# Altium project SCB.PrjPCB (part 2 of 2)

## Sheet FPGA_Configuration.SchDoc: FPGA_Configuration
size A3; Date: 18/06/2014; DrawnBy: J. Gabriel R.E.; Organization: Seven Solutions S.L.; Address1: C/Baza, Parcela 19, Nave 3; Address2: Polнgono Ind. Juncaril; Address3: 18210-Peligros-Granada; Address4: Spain; Revision: 3.4; SheetNumber: 8; SheetTotal: 23; WebAddress: www.sevensols.com; Project: White Rabbit; ProjectName: Project Name
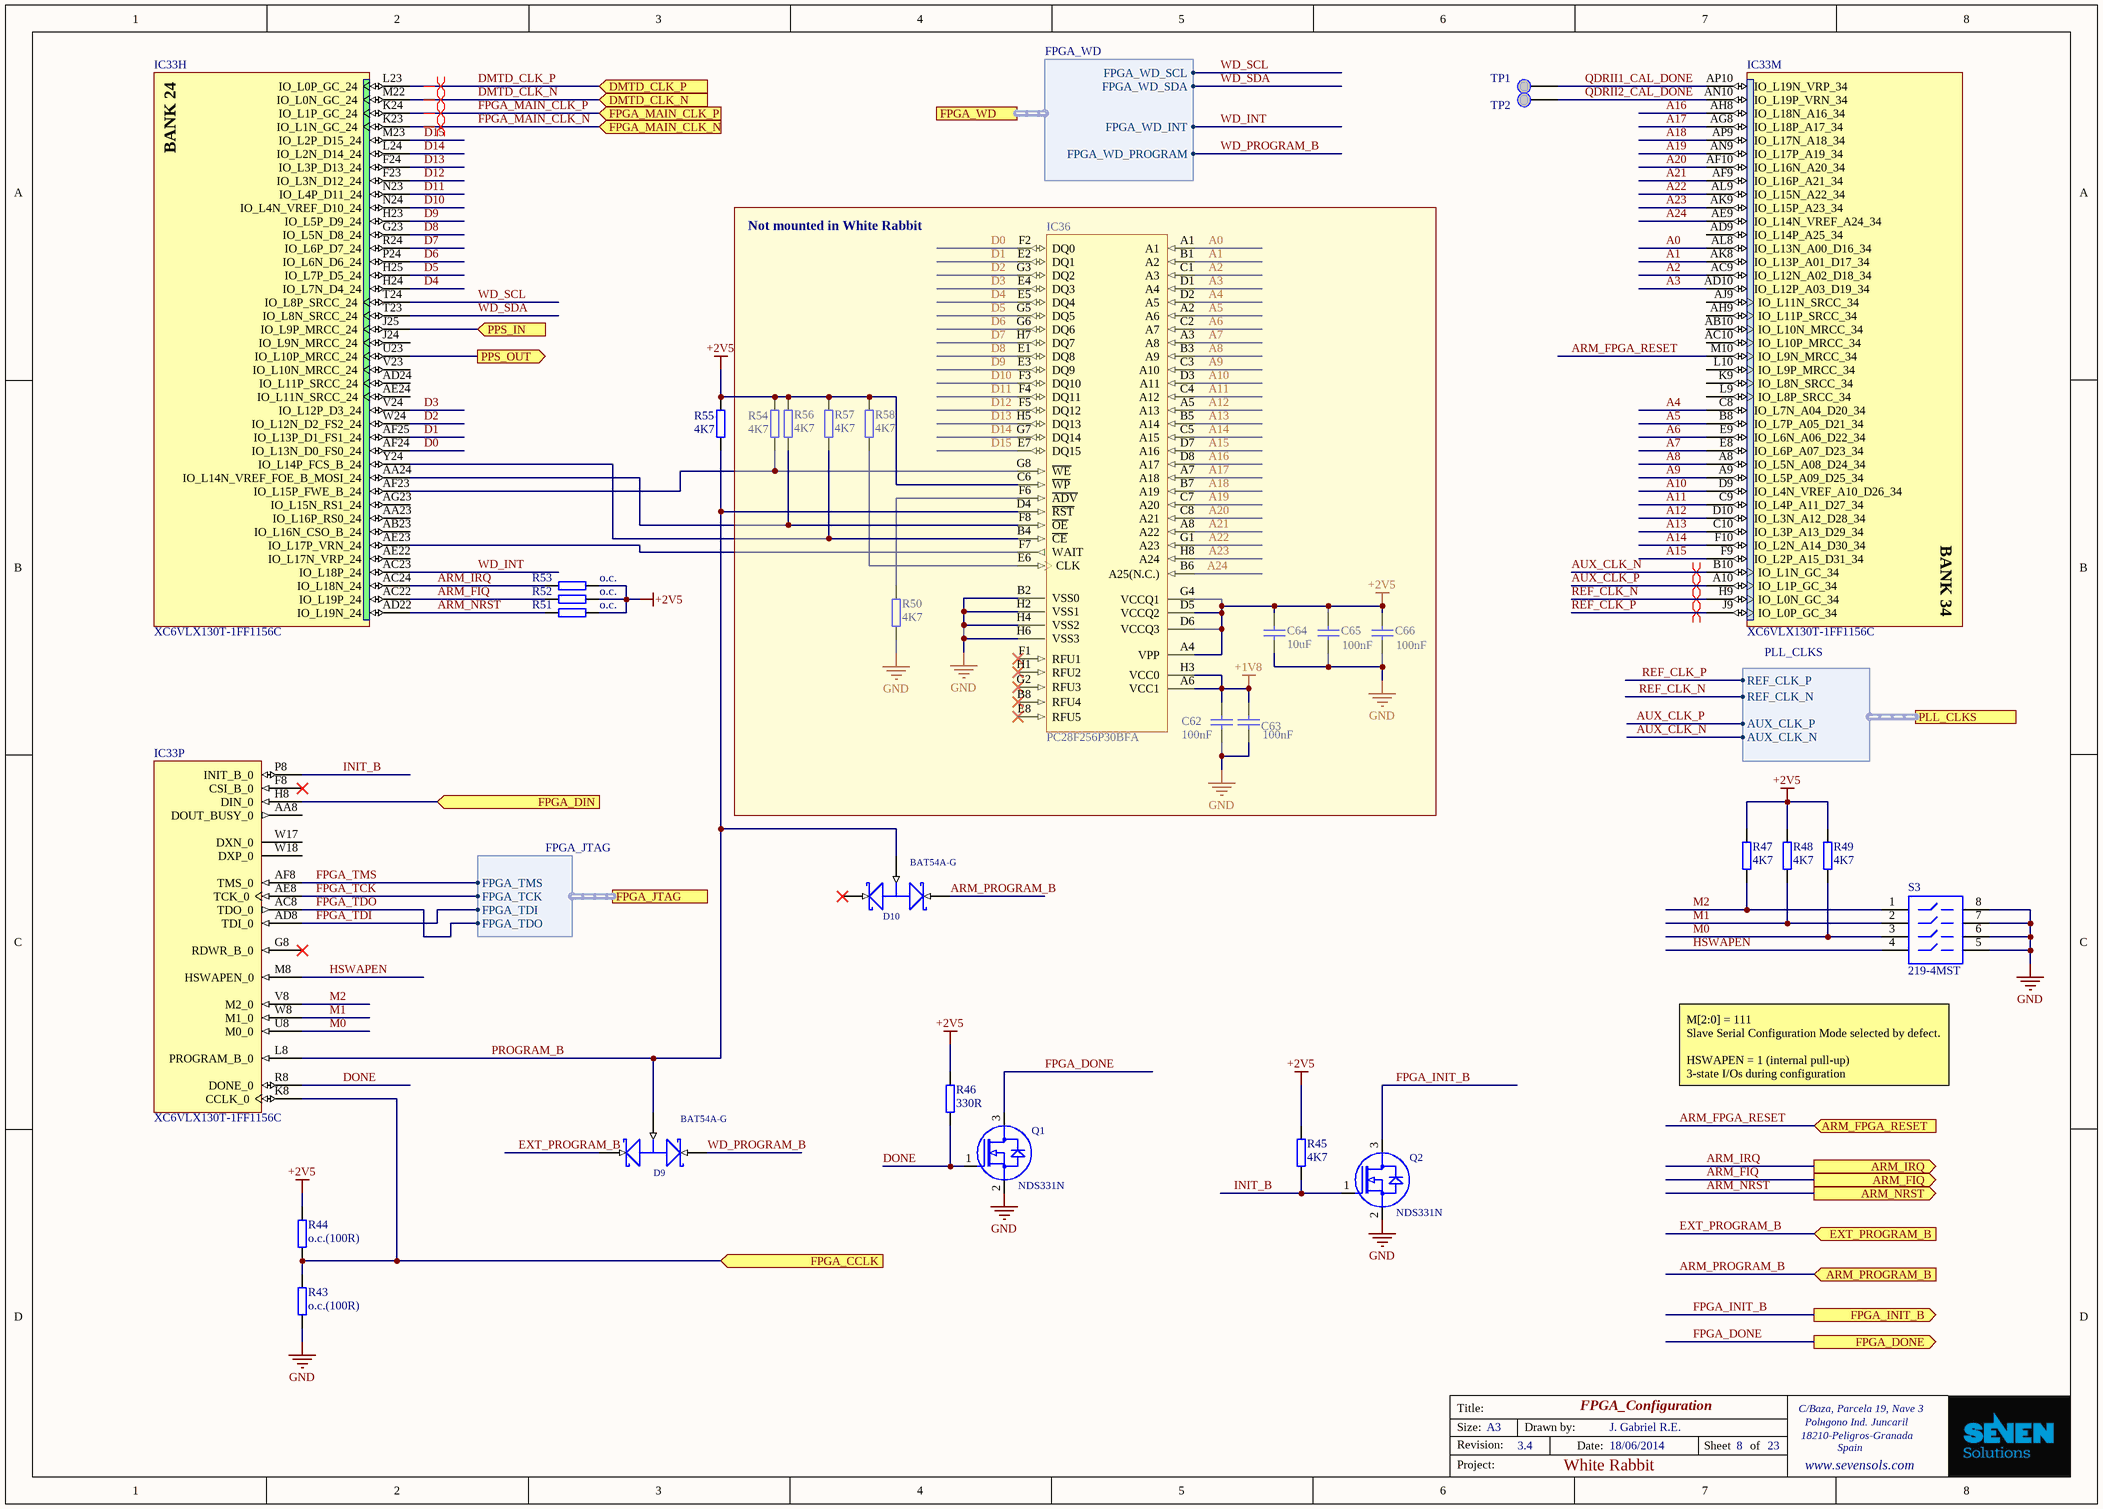
[diagram p4: FPGA_Configuration.SchDoc]

### Parts
C62  100nF  [CC1005-0402]
C63  100nF  [CC1005-0402]
C64  10uF  [CC1608-0603]
C65  100nF  [CC1005-0402]
C66  100nF  [CC1005-0402]
D9  BAT54A-G  [SOT23]
D10  BAT54A-G  [SOT23]
IC33  XC6VLX130T-1FF1156C  [FF1156]  (parts H,M,P of 20)
IC36  PC28F256P30BFA  [BGA64C100P8X8_1300X1000X120]
Q1  NDS331N  [SOT23-3]
Q2  NDS331N  [SOT23-3]
R43  value o.c.(100R)  [0402]  (hidden comment: 100R(o.c.))
R44  value o.c.(100R)  [0402]  (hidden comment: 100R(o.c.))
R45  4K7  [0402]
R46  330R  [0402]
R47  4K7  [0402]
R48  4K7  [0402]
R49  4K7  [0402]
R50  4K7  [0402]
R51  o.c.  [0402]
R52  o.c.  [0402]
R53  o.c.  [0402]
R54  4K7  [0402]
R55  4K7  [0402]
R56  4K7  [0402]
R57  4K7  [0402]
R58  4K7  [0402]
S3  219-4MST  [NHDS-8]
TP1  Test Point  [TEST_PAD_1mm]  (value not drawn)
TP2  Test Point  [TEST_PAD_1mm]  (value not drawn)

### Blocks framed on the sheet
Not mounted in White Rabbit: C62-C66 IC36 R50 R54 R56-R58

### Ports
ARM_FIQ (out), ARM_FPGA_RESET (in), ARM_IRQ (out), ARM_NRST (out), ARM_PROGRAM_B (in), DMTD_CLK_N (in), DMTD_CLK_P (in), EXT_PROGRAM_B (in), FPGA_CCLK (in), FPGA_DIN (in), FPGA_DONE (out), FPGA_INIT_B (out), FPGA_JTAG (harness FPGA_JTAG), FPGA_MAIN_CLK_N (in), FPGA_MAIN_CLK_P (in), FPGA_WD (harness FPGA_WD), PLL_CLKS (harness PLL_CLKS), PPS_IN (in), PPS_OUT (out)

### Harnesses
FPGA_JTAG: FPGA_TMS, FPGA_TCK, FPGA_TDI, FPGA_TDO
FPGA_WD: FPGA_WD_SCL, FPGA_WD_SDA, FPGA_WD_INT, FPGA_WD_PROGRAM
PLL_CLKS: REF_CLK_P, REF_CLK_N, AUX_CLK_P, AUX_CLK_N

### Nets
+1V8: C62.2 C63.2 IC36.A6(VCC1) IC36.H3(VCC0)
+2V5: C64.2 C65.2 C66.2 IC36.A4(VPP) IC36.C6(~{WP}) IC36.D5(VCCQ2) IC36.D6(VCCQ3) IC36.G4(VCCQ1) R44.2 R45.1 R46.2 R47.2 R48.2 R49.2 R51.1 R52.1 R53.1 R54.2 R55.2 R56.2 R57.2 R58.2
GND: C62.1 C63.1 C64.1 C65.1 C66.1 IC36.B2(VSS0) IC36.H2(VSS1) IC36.H4(VSS2) IC36.H6(VSS3) Q1.2(SOURCE) Q2.2(SOURCE) R43.1 R50.1 S3.5 S3.6 S3.7 S3.8
A0: IC33.AL8(IO_L13N_A00_D16_34) IC36.A1
A1: IC33.AK8(IO_L13P_A01_D17_34) IC36.B1(A2)
A2: IC33.AC9(IO_L12N_A02_D18_34) IC36.C1(A3)
A3: IC33.AD10(IO_L12P_A03_D19_34) IC36.D1(A4)
A4: IC33.C8(IO_L7N_A04_D20_34) IC36.D2(A5)
A5: IC33.B8(IO_L7P_A05_D21_34) IC36.A2(A6)
A6: IC33.E9(IO_L6N_A06_D22_34) IC36.C2(A7)
A7: IC33.E8(IO_L6P_A07_D23_34) IC36.A3(A8)
A8: IC33.A8(IO_L5N_A08_D24_34) IC36.B3(A9)
A9: IC33.A9(IO_L5P_A09_D25_34) IC36.C3(A10)
A10: IC33.D9(IO_L4N_VREF_A10_D26_34) IC36.D3(A11)
A11: IC33.C9(IO_L4P_A11_D27_34) IC36.C4(A12)
A12: IC33.D10(IO_L3N_A12_D28_34) IC36.A5(A13)
A13: IC33.C10(IO_L3P_A13_D29_34) IC36.B5(A14)
A14: IC33.F10(IO_L2N_A14_D30_34) IC36.C5(A15)
A15: IC33.F9(IO_L2P_A15_D31_34) IC36.D7(A16)
A16: IC33.AH8(IO_L18N_A16_34) IC36.D8(A17)
A17: IC33.AG8(IO_L18P_A17_34) IC36.A7(A18)
A18: IC33.AP9(IO_L17N_A18_34) IC36.B7(A19)
A19: IC33.AN9(IO_L17P_A19_34) IC36.C7(A20)
A20: IC33.AF10(IO_L16N_A20_34) IC36.C8(A21)
A21: IC33.AF9(IO_L16P_A21_34) IC36.A8(A22)
A22: IC33.AL9(IO_L15N_A22_34) IC36.G1(A23)
A23: IC33.AK9(IO_L15P_A23_34) IC36.H8(A24)
A24: IC33.AE9(IO_L14N_VREF_A24_34) IC36.B6(A25(N.C.))
ARM_FIQ: IC33.AC22(IO_L19P_24) R52.2 ; port ARM_FIQ
ARM_FPGA_RESET: IC33.M10(IO_L9N_MRCC_34) ; port ARM_FPGA_RESET
ARM_IRQ: IC33.AC24(IO_L18N_24) R53.2 ; port ARM_IRQ
ARM_NRST: IC33.AD22(IO_L19N_24) R51.2 ; port ARM_NRST
ARM_PROGRAM_B: D10.2(K2) ; port ARM_PROGRAM_B
AUX_CLK_N: IC33.B10(IO_L1N_GC_34) ; port PLL_CLKS.AUX_CLK_N
AUX_CLK_P: IC33.A10(IO_L1P_GC_34) ; port PLL_CLKS.AUX_CLK_P
D0: IC33.AF24(IO_L13N_D0_FS0_24) IC36.F2(DQ0)
D1: IC33.AF25(IO_L13P_D1_FS1_24) IC36.E2(DQ1)
D2: IC33.W24(IO_L12N_D2_FS2_24) IC36.G3(DQ2)
D3: IC33.V24(IO_L12P_D3_24) IC36.E4(DQ3)
D4: IC33.H24(IO_L7N_D4_24) IC36.E5(DQ4)
D5: IC33.H25(IO_L7P_D5_24) IC36.G5(DQ5)
D6: IC33.P24(IO_L6N_D6_24) IC36.G6(DQ6)
D7: IC33.R24(IO_L6P_D7_24) IC36.H7(DQ7)
D8: IC33.G23(IO_L5N_D8_24) IC36.E1(DQ8)
D9: IC33.H23(IO_L5P_D9_24) IC36.E3(DQ9)
D10: IC33.N24(IO_L4N_VREF_D10_24) IC36.F3(DQ10)
D11: IC33.N23(IO_L4P_D11_24) IC36.F4(DQ11)
D12: IC33.F23(IO_L3N_D12_24) IC36.F5(DQ12)
D13: IC33.F24(IO_L3P_D13_24) IC36.H5(DQ13)
D14: IC33.L24(IO_L2N_D14_24) IC36.G7(DQ14)
D15: IC33.M23(IO_L2P_D15_24) IC36.E7(DQ15)
DMTD_CLK_N: IC33.M22(IO_L0N_GC_24) ; port DMTD_CLK_N
DMTD_CLK_P: IC33.L23(IO_L0P_GC_24) ; port DMTD_CLK_P
DONE: IC33.R8(DONE_0) Q1.1(GATE) R46.1
EXT_PROGRAM_B: D9.1(K1) ; port EXT_PROGRAM_B
FPGA_DONE: Q1.3(DRAIN) ; port FPGA_DONE
FPGA_INIT_B: Q2.3(DRAIN) ; port FPGA_INIT_B
FPGA_MAIN_CLK_N: IC33.K23(IO_L1N_GC_24) ; port FPGA_MAIN_CLK_N
FPGA_MAIN_CLK_P: IC33.K24(IO_L1P_GC_24) ; port FPGA_MAIN_CLK_P
FPGA_TCK: IC33.AE8(TCK_0) ; port FPGA_JTAG.FPGA_TCK
FPGA_TDI: IC33.AD8(TDI_0) ; port FPGA_JTAG.FPGA_TDI
FPGA_TDO: IC33.AC8(TDO_0) ; port FPGA_JTAG.FPGA_TDO
FPGA_TMS: IC33.AF8(TMS_0) ; port FPGA_JTAG.FPGA_TMS
HSWAPEN: IC33.M8(HSWAPEN_0) S3.4
INIT_B: IC33.P8(INIT_B_0) Q2.1(GATE) R45.2
M0: IC33.U8(M0_0) R49.1 S3.3
M1: IC33.W8(M1_0) R48.1 S3.2
M2: IC33.V8(M2_0) R47.1 S3.1
PROGRAM_B: D9.3(A) D10.3(A) IC33.L8(PROGRAM_B_0) IC36.D4(~{RST}) R55.1
QDRII1_CAL_DONE: IC33.AP10(IO_L19N_VRP_34) TP1.1(TP)
QDRII2_CAL_DONE: IC33.AN10(IO_L19P_VRN_34) TP2.1(TP)
REF_CLK_N: IC33.H9(IO_L0N_GC_34) ; port PLL_CLKS.REF_CLK_N
REF_CLK_P: IC33.J9(IO_L0P_GC_34) ; port PLL_CLKS.REF_CLK_P
WD_INT: IC33.AC23(IO_L18P_24) ; port FPGA_WD.FPGA_WD_INT
WD_PROGRAM_B: D9.2(K2) ; port FPGA_WD.FPGA_WD_PROGRAM
WD_SCL: IC33.T24(IO_L8P_SRCC_24) ; port FPGA_WD.FPGA_WD_SCL
WD_SDA: IC33.T23(IO_L8N_SRCC_24) ; port FPGA_WD.FPGA_WD_SDA
NetIC33_AA24: IC33.AA24(IO_L14N_VREF_FOE_B_MOSI_24) IC36.F8(~{OE}) R56.1
NetIC33_AE23: IC33.AE23(IO_L17P_VRN_24) IC36.F7(WAIT)
NetIC33_AF23: IC33.AF23(IO_L15P_FWE_B_24) IC36.G8(~{WE}) R54.1
NetIC33_H8: IC33.H8(DIN_0) ; port FPGA_DIN
NetIC33_J25: IC33.J25(IO_L9P_MRCC_24) ; port PPS_IN
NetIC33_K8: IC33.K8(CCLK_0) R43.2 R44.1 ; port FPGA_CCLK
NetIC33_U23: IC33.U23(IO_L10P_MRCC_24) ; port PPS_OUT
NetIC33_Y24: IC33.Y24(IO_L14P_FCS_B_24) IC36.B4(~{CE}) R57.1
NetIC36_E6: IC36.E6(CLK) R58.1
NetIC36_F6: IC36.F6(~{ADV}) R50.2

Not connected (* = marked no-connect by the designer): D10 1(K1)*; IC33 AA8(DOUT_BUSY_0) AA23(IO_L16P_RS0_24) AB10(IO_L10N_MRCC_34) AB23(IO_L16N_CSO_B_24) AC10(IO_L10P_MRCC_34) AD9(IO_L14P_A25_34) AD24(IO_L11P_SRCC_24) AE22(IO_L17N_VRP_24) AE24(IO_L11N_SRCC_24) AG23(IO_L15N_RS1_24) AH9(IO_L11P_SRCC_34) AJ9(IO_L11N_SRCC_34) F8(CSI_B_0)* G8(RDWR_B_0)* J24(IO_L9N_MRCC_24) K9(IO_L8N_SRCC_34) L9(IO_L8P_SRCC_34) L10(IO_L9P_MRCC_34) V23(IO_L10N_MRCC_24) W17(DXN_0) W18(DXP_0); IC36 B8(RFU4)* E8(RFU5)* F1(RFU1)* G2(RFU3)* H1(RFU2)*

### Layout directives
differential pair: AUX_CLK_N, AUX_CLK_P, DMTD_CLK_N, DMTD_CLK_P, FPGA_MAIN_CLK_N, FPGA_MAIN_CLK_P, REF_CLK_N, REF_CLK_P

### Notes on the sheet
- M[2:0] = 111
  Slave Serial Configuration Mode selected by defect.
  HSWAPEN = 1 (internal pull-up)
  3-state I/Os during configuration
- Title:
- Size:
- Revision:
- A3
- Drawn by:
- Date:
- Sheet
- of
- Project:
- (in symbol XC6VLX130T-1FF1156C, part H) BANK 24
- (in symbol XC6VLX130T-1FF1156C, part M) BANK 34

### Library data of the parts
C62 C63 C65 C66 = CC0402_100NF_16V_10%_X7R: Capacitor; Manufacturer1: TDK; Manufacturer1 PN: C1005X7R1C104K; TC: X7R; Tolerance: ±10%; Voltage: 16V; Mounted: No; Published: 8-Jun-2000; LatestRevisionDate: 17-Jul-2002; LatestRevisionNote: Re-released for DXP Platform.; PackageReference: RAD-0.3; Publisher: Altium Limited; Distributor1: Digikey; Distributor1 PN: 445-4952-1-ND; Case: 0402; Value: 100nF
C64 = CC0603_10UF_6.3V_20%_X5R: Capacitor; Manufacturer1: TDK; Manufacturer1 PN: C1608X5R0J106M; TC: X5R; Tolerance: ±20%; Voltage: 6.3V; Mounted: No; Published: 8-Jun-2000; LatestRevisionDate: 17-Jul-2002; LatestRevisionNote: Re-released for DXP Platform.; PackageReference: RAD-0.3; Publisher: Altium Limited; Distributor1: Digikey; Distributor1 PN: 445-4112-1-ND; Case: 0603; Value: 10uF
D9 D10 = BAT54A.1: Schottky Barrier Double Diode; PACKAGE_INFORMATION: Latest Revision: May-1999; DEVICE: BAT54A-G; PKG_TYPE: SOT23; PUBLISHED: 17-Sep-2003; DATASHEET: Latest Revision: 4-Mar-2002; PACKAGE_REFERENCE: SOT23; PUBLISHER: Altium Limited; Value: BAT54A-G; Distributor1 PN: 641-1319-1-ND; Distributor1: Digikey
IC33 = XC6VLX130T-1FF1156C: Virtex-6 LXT Platform FPGA, 600 User I/Os, 20 GTXs, 1156-Ball FFBGA, Speed Grade 1, Commercial Grade; FirstPublished: 17-Nov-2009; DatasheetVersion: v2.0, Sep-2009; PackageVersion: ver1.0, Jun-2009; PackageReference: FF1156; Publisher: Altium Limited; PackageDescription: 1156-Ball Flip-Chip Fine Pitch Ball Grid Array (FF1156); Code_JEDEC: MS-034-AAR-1; Code_IPC: BGA100P34X34-1156; ComponentLink1Description: Virtex-6 Datasheet; ComponentLink1URL: http://www.xilinx.com/support/documentation/data_sheets/ds150.pdf; ComponentLink2Description: Pinout Specification; ComponentLink2URL: http://www.xilinx.com/support/packagefiles/virtex-6-pkgs.htm; ComponentLink3Description: FF1156 Package Drawing; ComponentLink3URL: http://www.xilinx.com/support/documentation/package_specs/ff1156.pdf; ComponentLink4Description: Virtex-6 Documents; ComponentLink4URL: http://www.xilinx.com/support/documentation/virtex-6.htm; ComponentLink5Description: Xilinx.com Home; ComponentLink5URL: http://www.xilinx.com
IC36 = PC28F256P30BFA: NOR Flash Memory, 256Mbit; Mounted: No; Value: PC28F256P30BFA; Distributor1 PN: PC28F256P30BFA-ND; Distributor1: Digikey; Case: TBGA-64
Q1 Q2 = NDS331N: N-Channel Logic Level Enhancement Mode Field Effect Transistor; DEVICE: NDS331N; VALUE: NDS331N; Distributor1 PN: NDS331NCT-ND; Distributor1: Digikey
R43 = R0402_100R_±1%_0.1W_100PPM: SMD Resistor; Manufacturer1: Panasonic; Manufacturer1 PN: ERJ-2RKF1000X; TCR: 100ppm; Power Rating: 0.1W; Tolerance: ±1%; Mounted: No; Case: 0402; Distributor1: DigiKey; Distributor1 PN: P100LCT-ND
R44 = R0402_100R_±1%_0.1W_100PPM: as R193 on sheet RS232_and_USB_ports; Case: 0402; Distributor1: DigiKey; Distributor1 PN: P100LCT-ND
R45 R47-R49 R55 = R0402_4.7K_±1%_0.1W_100PPM: as R200 on sheet CPU_100M_Ethernet; Case: 0402; Distributor1: DigiKey; Distributor1 PN: ERJ-2RKF4701X; Value: 4K7
R46 = R0402_330R_±1%_0.1W_100PPM: SMD Resistor; Manufacturer1: Panasonic; Manufacturer1 PN: ERJ-2RKF3300X; TCR: 100ppm; Power Rating: 0.1W; Tolerance: ±1%; Case: 0402; Distributor1: DigiKey; Distributor1 PN: P330LCT-ND; Value: 330R
R50 R54 R56-R58 = R0402_4.7K_±1%_0.1W_100PPM: SMD Resistor; Manufacturer1: Panasonic; Manufacturer1 PN: ERJ-2RKF4701X; TCR: 100ppm; Power Rating: 0.1W; Tolerance: ±1%; Mounted: No; Case: 0402; Distributor1: DigiKey; Distributor1 PN: ERJ-2RKF4701X; Value: 4K7
R51-R53 = R0402_O.C.: SMD Resistor; Mounted: No; Case: 0402; Manufacturer1: N/A; Manufacturer1 PN: N/A; Distributor1: N/A; Distributor1 PN: N/A; TCR: N/A; Power Rating: N/A; Tolerance: N/A; Value: o.c.
S3 = SW-DIP4: 4 Positions DIP SWITCH; Manufacturer: CTS Electrocomponents; Mounted: No; Value: 219-4MST; Distributor1 PN: CT2194MST-ND; Distributor1: Digikey
TP1 TP2 = TEST_POINT: SMD 1mm Test Point

## Sheet uTCA_Tongue3.SchDoc: uTCA_Tongue3
size A4 portrait; Revision: 3.4; SheetNumber: 14; SheetTotal: 23; Date: 18/06/2014; DrawnBy: J. Gabriel R.E.; Organization: Seven Solutions S.L.; Address1: C/Baza, Parcela 19, Nave 3; Address2: Polнgono Ind. Juncaril; Address3: 18210-Peligros-Granada; Address4: Spain; WebAddress: www.sevensols.com; Project: White Rabbit; ProjectName: White Rabbit
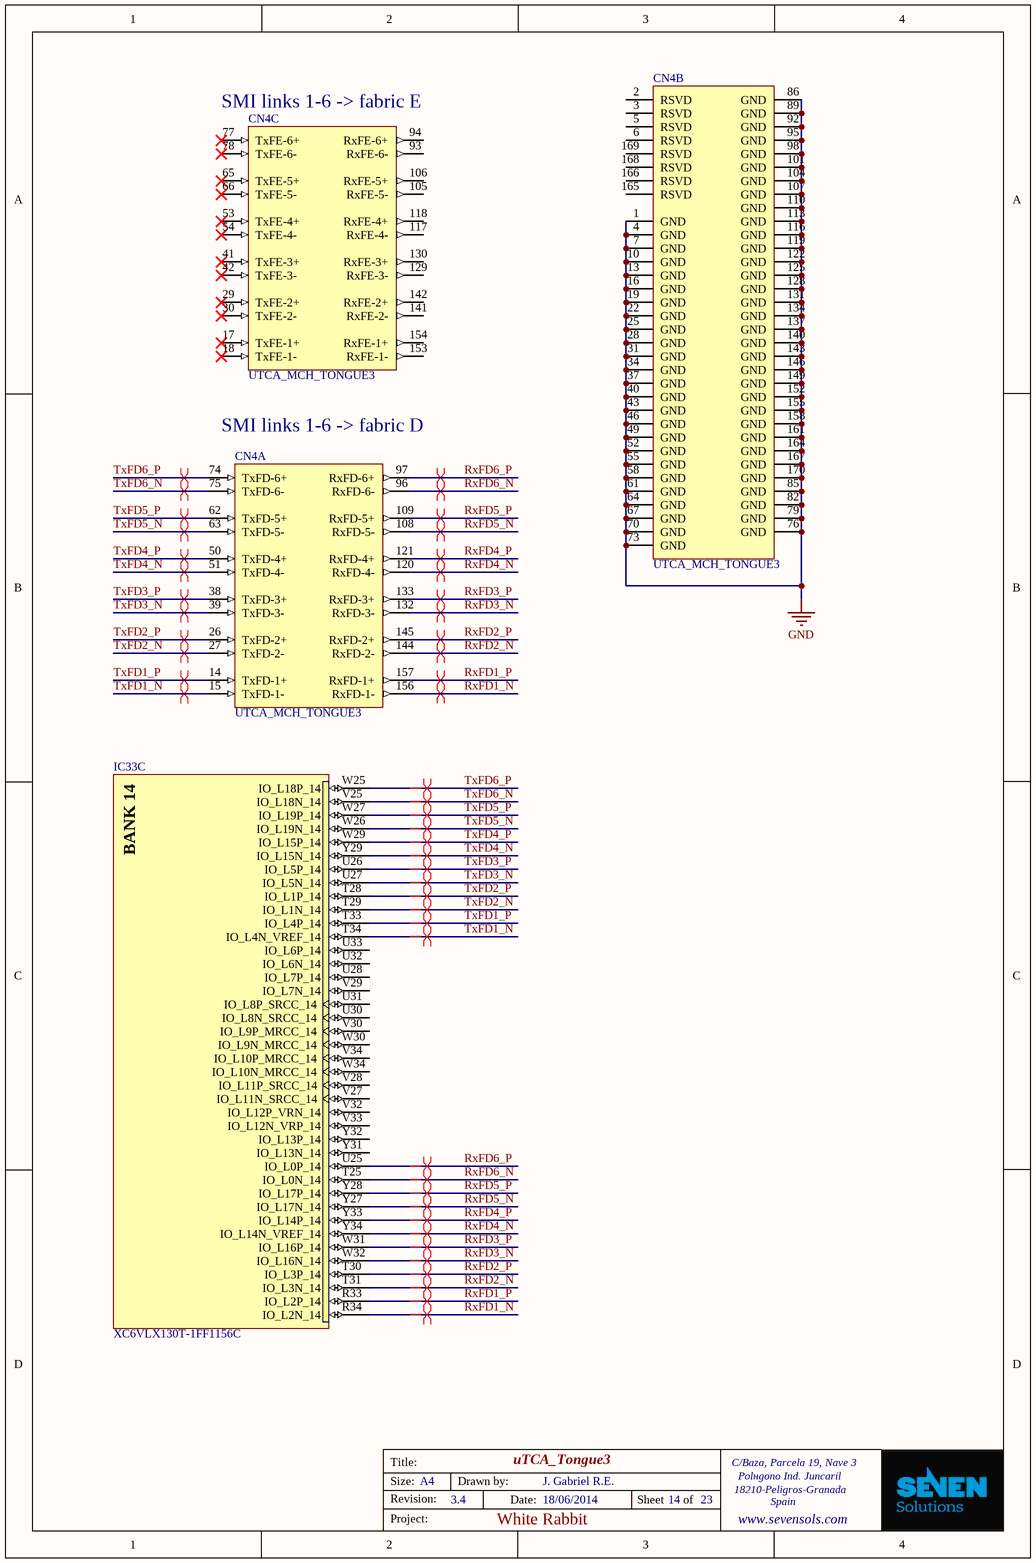
[diagram p5: uTCA_Tongue3.SchDoc]

### Parts
CN4  UTCA_MCH_TONGUE3  [UTCA_MCH_TONGUE2_3_4]  (parts A,B,C of 7)
IC33  XC6VLX130T-1FF1156C  [FF1156]  (part C of 20)

### Nets
GND: CN4.1(GND) CN4.4(GND) CN4.7(GND) CN4.10(GND) CN4.13(GND) CN4.16(GND) CN4.19(GND) CN4.22(GND) CN4.25(GND) CN4.28(GND) CN4.31(GND) CN4.34(GND) CN4.37(GND) CN4.40(GND) CN4.43(GND) CN4.46(GND) CN4.49(GND) CN4.52(GND) CN4.55(GND) CN4.58(GND) CN4.61(GND) CN4.64(GND) CN4.67(GND) CN4.70(GND) CN4.73(GND) CN4.76(GND) CN4.79(GND) CN4.82(GND) CN4.85(GND) CN4.86(GND) CN4.89(GND) CN4.92(GND) CN4.95(GND) CN4.98(GND) CN4.101(GND) CN4.104(GND) CN4.107(GND) CN4.110(GND) CN4.113(GND) CN4.116(GND) CN4.119(GND) CN4.122(GND) CN4.125(GND) CN4.128(GND) CN4.131(GND) CN4.134(GND) CN4.137(GND) CN4.140(GND) CN4.143(GND) CN4.146(GND) CN4.149(GND) CN4.152(GND) CN4.155(GND) CN4.158(GND) CN4.161(GND) CN4.164(GND) CN4.167(GND) CN4.170(GND)
RxFD1_N: CN4.156(RxFD-1-) IC33.R34(IO_L2N_14)
RxFD1_P: CN4.157(RxFD-1+) IC33.R33(IO_L2P_14)
RxFD2_N: CN4.144(RxFD-2-) IC33.T31(IO_L3N_14)
RxFD2_P: CN4.145(RxFD-2+) IC33.T30(IO_L3P_14)
RxFD3_N: CN4.132(RxFD-3-) IC33.W32(IO_L16N_14)
RxFD3_P: CN4.133(RxFD-3+) IC33.W31(IO_L16P_14)
RxFD4_N: CN4.120(RxFD-4-) IC33.Y34(IO_L14N_VREF_14)
RxFD4_P: CN4.121(RxFD-4+) IC33.Y33(IO_L14P_14)
RxFD5_N: CN4.108(RxFD-5-) IC33.Y27(IO_L17N_14)
RxFD5_P: CN4.109(RxFD-5+) IC33.Y28(IO_L17P_14)
RxFD6_N: CN4.96(RxFD-6-) IC33.T25(IO_L0N_14)
RxFD6_P: CN4.97(RxFD-6+) IC33.U25(IO_L0P_14)
TxFD1_N: CN4.15(TxFD-1-) IC33.T34(IO_L4N_VREF_14)
TxFD1_P: CN4.14(TxFD-1+) IC33.T33(IO_L4P_14)
TxFD2_N: CN4.27(TxFD-2-) IC33.T29(IO_L1N_14)
TxFD2_P: CN4.26(TxFD-2+) IC33.T28(IO_L1P_14)
TxFD3_N: CN4.39(TxFD-3-) IC33.U27(IO_L5N_14)
TxFD3_P: CN4.38(TxFD-3+) IC33.U26(IO_L5P_14)
TxFD4_N: CN4.51(TxFD-4-) IC33.Y29(IO_L15N_14)
TxFD4_P: CN4.50(TxFD-4+) IC33.W29(IO_L15P_14)
TxFD5_N: CN4.63(TxFD-5-) IC33.W26(IO_L19N_14)
TxFD5_P: CN4.62(TxFD-5+) IC33.W27(IO_L19P_14)
TxFD6_N: CN4.75(TxFD-6-) IC33.V25(IO_L18N_14)
TxFD6_P: CN4.74(TxFD-6+) IC33.W25(IO_L18P_14)

Not connected (* = marked no-connect by the designer): CN4 2(RSVD) 3(RSVD) 5(RSVD) 6(RSVD) 17(TxFE-1+)* 18(TxFE-1-)* 29(TxFE-2+)* 30(TxFE-2-)* 41(TxFE-3+)* 42(TxFE-3-)* 53(TxFE-4+)* 54(TxFE-4-)* 65(TxFE-5+)* 66(TxFE-5-)* 77(TxFE-6+)* 78(TxFE-6-)* 93(RxFE-6-) 94(RxFE-6+) 105(RxFE-5-) 106(RxFE-5+) 117(RxFE-4-) 118(RxFE-4+) 129(RxFE-3-) 130(RxFE-3+) 141(RxFE-2-) 142(RxFE-2+) 153(RxFE-1-) 154(RxFE-1+) 165(RSVD) 166(RSVD) 168(RSVD) 169(RSVD); IC33 U28(IO_L7P_14) U30(IO_L8N_SRCC_14) U31(IO_L8P_SRCC_14) U32(IO_L6N_14) U33(IO_L6P_14) V27(IO_L11N_SRCC_14) V28(IO_L11P_SRCC_14) V29(IO_L7N_14) V30(IO_L9P_MRCC_14) V32(IO_L12P_VRN_14) V33(IO_L12N_VRP_14) V34(IO_L10P_MRCC_14) W30(IO_L9N_MRCC_14) W34(IO_L10N_MRCC_14) Y31(IO_L13N_14) Y32(IO_L13P_14)

### Layout directives
differential pair: RxFD1_N, RxFD1_P, RxFD2_N, RxFD2_P, RxFD3_N, RxFD3_P, RxFD4_N, RxFD4_P, RxFD5_N, RxFD5_P, RxFD6_N, RxFD6_P, TxFD1_N, TxFD1_P, TxFD2_N, TxFD2_P, TxFD3_N, TxFD3_P, TxFD4_N, TxFD4_P, TxFD5_N, TxFD5_P, TxFD6_N, TxFD6_P

### Notes on the sheet
- (near CN4) SMI links 1-6 -> fabric E
- (near CN4) SMI links 1-6 -> fabric D
- Title:
- Size:
- Revision:
- A4
- Drawn by:
- Date:
- Sheet
- of
- Project:
- (in symbol XC6VLX130T-1FF1156C, part C) BANK 14

### Library data of the parts
CN4 = UTCA_MCH_TONGUE3: microTCA MTCA.0 standard MCH connector 3
IC33 = XC6VLX130T-1FF1156C: as IC33 on sheet FPGA_Configuration; FirstPublished: 17-Nov-2009; DatasheetVersion: v2.0, Sep-2009; PackageVersion: ver1.0, Jun-2009; PackageReference: FF1156; Publisher: Altium Limited; PackageDescription: 1156-Ball Flip-Chip Fine Pitch Ball Grid Array (FF1156); Code_JEDEC: MS-034-AAR-1; Code_IPC: BGA100P34X34-1156; ComponentLink1Description: Virtex-6 Datasheet; ComponentLink1URL: http://www.xilinx.com/support/documentation/data_sheets/ds150.pdf; ComponentLink2Description: Pinout Specification; ComponentLink2URL: http://www.xilinx.com/support/packagefiles/virtex-6-pkgs.htm; ComponentLink3Description: FF1156 Package Drawing; ComponentLink3URL: http://www.xilinx.com/support/documentation/package_specs/ff1156.pdf; ComponentLink4Description: Virtex-6 Documents; ComponentLink4URL: http://www.xilinx.com/support/documentation/virtex-6.htm; ComponentLink5Description: Xilinx.com Home; ComponentLink5URL: http://www.xilinx.com

## Sheet SMI_Link_7-12.SchDoc: SMI_Link_7-12
size A4; Date: 18/06/2014; DrawnBy: J. Gabriel R.E.; Organization: Seven Solutions S.L.; Address1: C/Baza, Parcela 19, Nave 3; Address2: Polнgono Ind. Juncaril; Address3: 18210-Peligros-Granada; Address4: Spain; Revision: 3.4; SheetNumber: 18; SheetTotal: 23; WebAddress: www.sevensols.com; Project: White Rabbit; ProjectName: White Rabbit
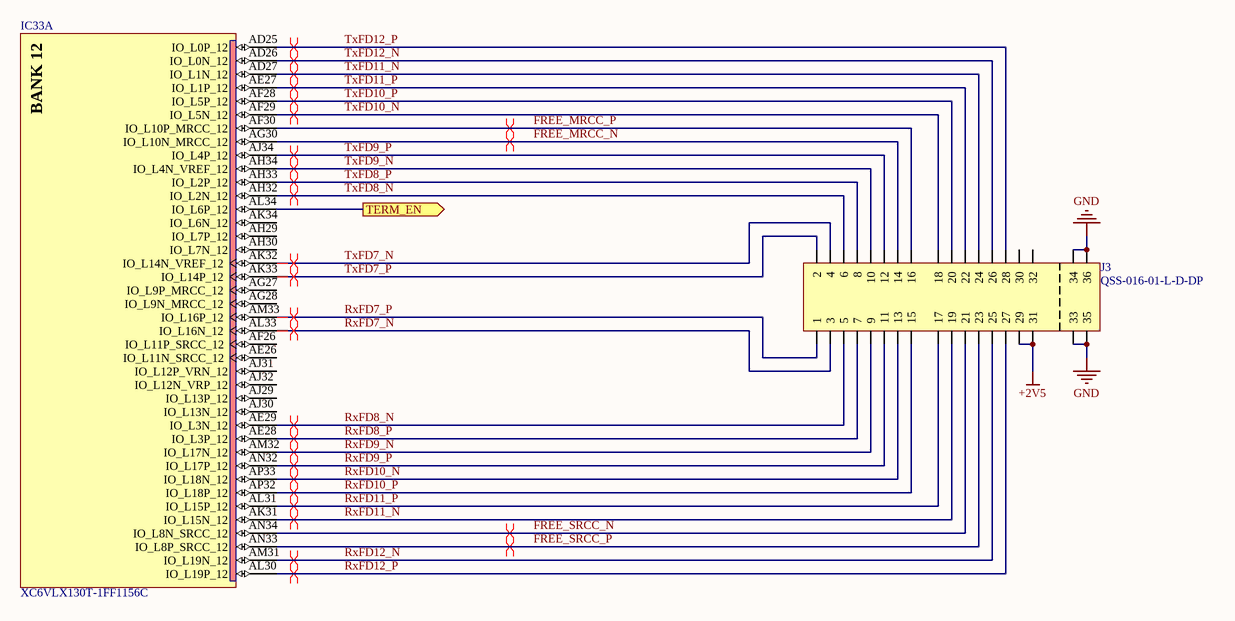
[diagram p6: SMI_Link_7-12.SchDoc]

### Parts
IC33  XC6VLX130T-1FF1156C  [FF1156]  (part A of 20)
J3  QSS-016-01-L-D-DP  [QSS-016-01-X-D-DP-A]

### Ports
TERM_EN (out)

### Nets
+2V5: J3.29 J3.31
GND: J3.33 J3.34 J3.35 J3.36
FREE_MRCC_N: IC33.AG30(IO_L10N_MRCC_12) J3.14
FREE_MRCC_P: IC33.AF30(IO_L10P_MRCC_12) J3.16
FREE_SRCC_N: IC33.AN34(IO_L8N_SRCC_12) J3.21
FREE_SRCC_P: IC33.AN33(IO_L8P_SRCC_12) J3.23
RxFD7_N: IC33.AL33(IO_L16N_12) J3.3
RxFD7_P: IC33.AM33(IO_L16P_12) J3.1
RxFD8_N: IC33.AE29(IO_L3N_12) J3.5
RxFD8_P: IC33.AE28(IO_L3P_12) J3.7
RxFD9_N: IC33.AM32(IO_L17N_12) J3.9
RxFD9_P: IC33.AN32(IO_L17P_12) J3.11
RxFD10_N: IC33.AP33(IO_L18N_12) J3.13
RxFD10_P: IC33.AP32(IO_L18P_12) J3.15
RxFD11_N: IC33.AK31(IO_L15N_12) J3.19
RxFD11_P: IC33.AL31(IO_L15P_12) J3.17
RxFD12_N: IC33.AM31(IO_L19N_12) J3.25
RxFD12_P: IC33.AL30(IO_L19P_12) J3.27
TxFD7_N: IC33.AK32(IO_L14N_VREF_12) J3.4
TxFD7_P: IC33.AK33(IO_L14P_12) J3.2
TxFD8_N: IC33.AH32(IO_L2N_12) J3.6
TxFD8_P: IC33.AH33(IO_L2P_12) J3.8
TxFD9_N: IC33.AH34(IO_L4N_VREF_12) J3.10
TxFD9_P: IC33.AJ34(IO_L4P_12) J3.12
TxFD10_N: IC33.AF29(IO_L5N_12) J3.18
TxFD10_P: IC33.AF28(IO_L5P_12) J3.20
TxFD11_N: IC33.AD27(IO_L1N_12) J3.24
TxFD11_P: IC33.AE27(IO_L1P_12) J3.22
TxFD12_N: IC33.AD26(IO_L0N_12) J3.26
TxFD12_P: IC33.AD25(IO_L0P_12) J3.28
NetIC33_AL34: IC33.AL34(IO_L6P_12) ; port TERM_EN

Not connected (* = marked no-connect by the designer): IC33 AE26(IO_L11N_SRCC_12) AF26(IO_L11P_SRCC_12) AG27(IO_L9P_MRCC_12) AG28(IO_L9N_MRCC_12) AH29(IO_L7P_12) AH30(IO_L7N_12) AJ29(IO_L13P_12) AJ30(IO_L13N_12) AJ31(IO_L12P_VRN_12) AJ32(IO_L12N_VRP_12) AK34(IO_L6N_12); J3 30 32

### Layout directives
differential pair: FREE_MRCC_N, FREE_MRCC_P, FREE_SRCC_N, FREE_SRCC_P, RxFD7_N, RxFD7_P, RxFD8_N, RxFD8_P, RxFD9_N, RxFD9_P, RxFD10_N, RxFD10_P, RxFD11_N, RxFD11_P, RxFD12_N, RxFD12_P, TxFD7_N, TxFD7_P, TxFD8_N, TxFD8_P, TxFD9_N, TxFD9_P, TxFD10_N, TxFD10_P, TxFD11_N, TxFD11_P, TxFD12_N, TxFD12_P

### Notes on the sheet
- Title:
- Size:
- Revision:
- A4
- Drawn by:
- Date:
- Sheet
- of
- Project:
- (in symbol XC6VLX130T-1FF1156C, part A) BANK 12

### Library data of the parts
IC33 = XC6VLX130T-1FF1156C: as IC33 on sheet FPGA_Configuration; FirstPublished: 17-Nov-2009; DatasheetVersion: v2.0, Sep-2009; PackageVersion: ver1.0, Jun-2009; PackageReference: FF1156; Publisher: Altium Limited; PackageDescription: 1156-Ball Flip-Chip Fine Pitch Ball Grid Array (FF1156); Code_JEDEC: MS-034-AAR-1; Code_IPC: BGA100P34X34-1156; ComponentLink1Description: Virtex-6 Datasheet; ComponentLink1URL: http://www.xilinx.com/support/documentation/data_sheets/ds150.pdf; ComponentLink2Description: Pinout Specification; ComponentLink2URL: http://www.xilinx.com/support/packagefiles/virtex-6-pkgs.htm; ComponentLink3Description: FF1156 Package Drawing; ComponentLink3URL: http://www.xilinx.com/support/documentation/package_specs/ff1156.pdf; ComponentLink4Description: Virtex-6 Documents; ComponentLink4URL: http://www.xilinx.com/support/documentation/virtex-6.htm; ComponentLink5Description: Xilinx.com Home; ComponentLink5URL: http://www.xilinx.com

## Sheet QDRII_mem.SchDoc: QDRII_mem
size A4 portrait; Date: 18/06/2014; DrawnBy: J. Gabriel R.E.; Organization: Seven Solutions S.L.; Address1: C/Baza, Parcela 19, Nave 3; Address2: Polнgono Ind. Juncaril; Address3: 18210-Peligros-Granada; Address4: Spain; Revision: 3.4; SheetNumber: 20; SheetTotal: 23; WebAddress: www.sevensols.com; Project: White Rabbit; ProjectName: Project Name
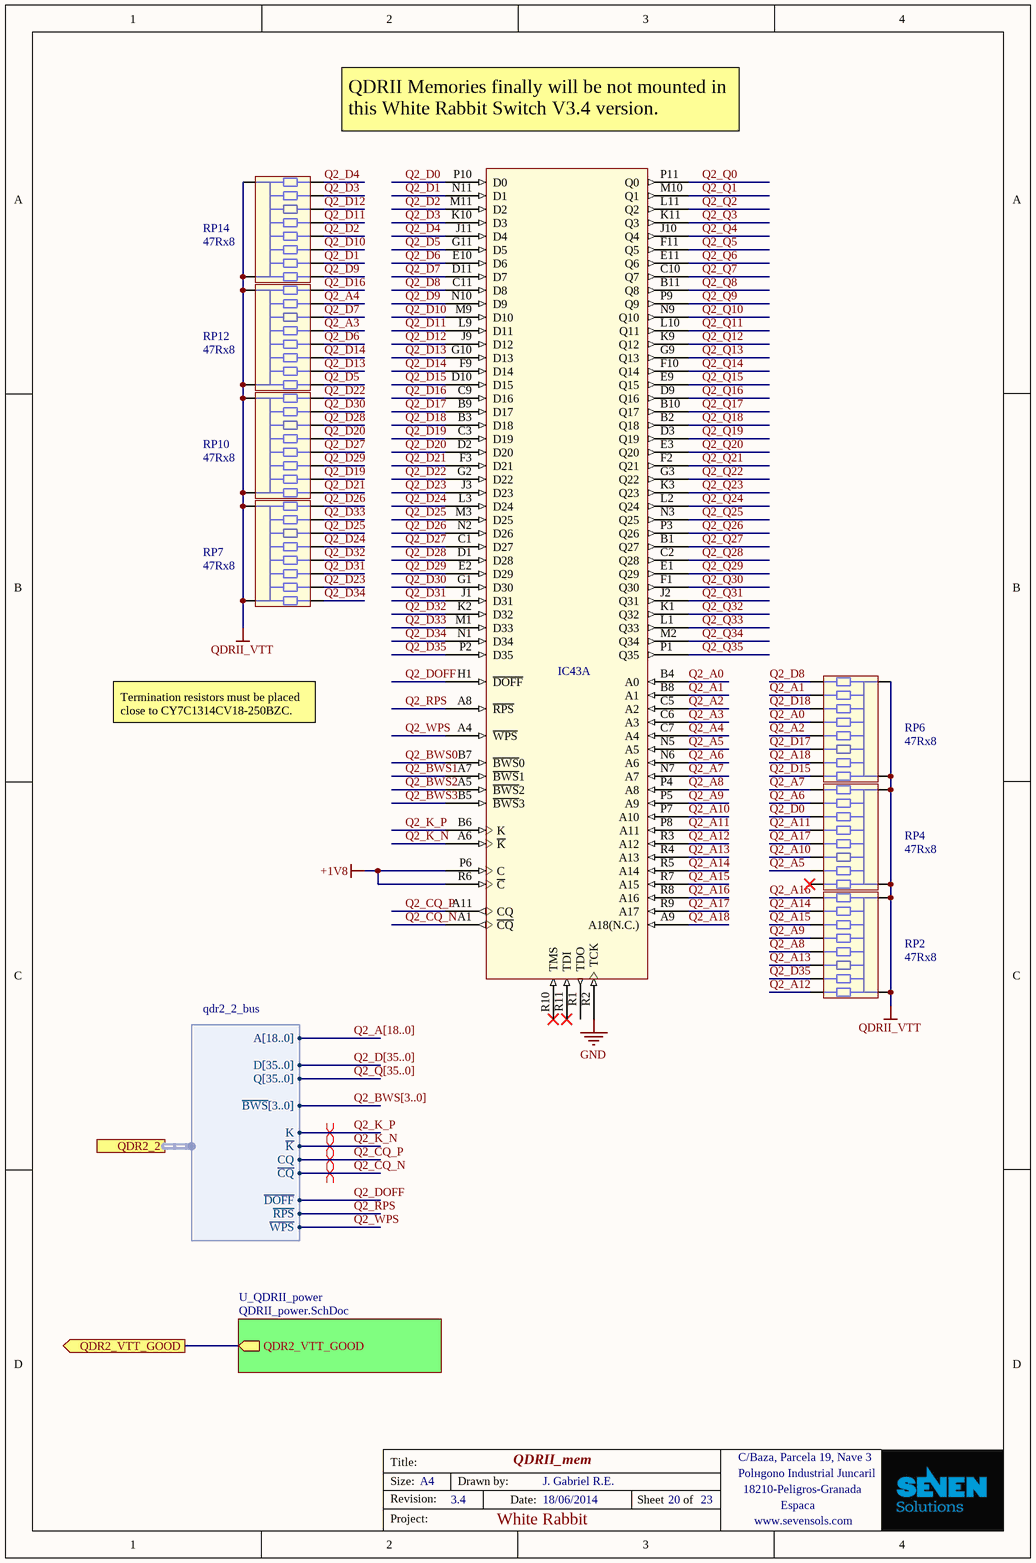
[diagram p7: QDRII_mem.SchDoc]

### Parts
IC43  CY7C1314KV18-250BZC  [BGA165C100P11X15_1300X1500X140]  (value not drawn)  (part A of 2)
RP2  value 47Rx8  [EXBE]  (hidden comment: 47R x 8)
RP4  value 47Rx8  [EXBE]  (hidden comment: 47R x 8)
RP6  value 47Rx8  [EXBE]  (hidden comment: 47R x 8)
RP7  value 47Rx8  [EXBE]  (hidden comment: 47R x 8)
RP10  value 47Rx8  [EXBE]  (hidden comment: 47R x 8)
RP12  value 47Rx8  [EXBE]  (hidden comment: 47R x 8)
RP14  value 47Rx8  [EXBE]  (hidden comment: 47R x 8)

### Sub-sheets
U_QDRII_power = QDRII_power.SchDoc: QDR2_VTT_GOOD (out)

### Ports
QDR2_2 (harness qdr2_2_bus), QDR2_VTT_GOOD (out)

### Harnesses
qdr2_2_bus: A[18..0], ~{BWS}[3..0], ~{CQ}, CQ, D[35..0], ~{DOFF}, K, ~{K}, Q[35..0], ~{RPS}, ~{WPS}

### Nets
+1V8: IC43.P6(C) IC43.R6(~{C})
GND: IC43.R2(TCK)
QDRII_VTT: RP2.1 RP2.6 RP4.1 RP4.6 RP6.1 RP6.6 RP7.1 RP7.6 RP10.1 RP10.6 RP12.1 RP12.6 RP14.1 RP14.6
Q2_A0: IC43.B4(A0) RP6.8
Q2_A1: IC43.B8(A1) RP6.10
Q2_A2: IC43.C5(A2) RP6.9
Q2_A3: IC43.C6(A3) RP12.7
Q2_A4: IC43.C7(A4) RP12.9
Q2_A5: IC43.N5(A5) RP4.8
Q2_A6: IC43.N6(A6) RP4.9
Q2_A7: IC43.N7(A7) RP4.10
Q2_A8: IC43.P4(A8) RP2.5
Q2_A9: IC43.P5(A9) RP2.8
Q2_A10: IC43.P7(A10) RP4.2
Q2_A11: IC43.P8(A11) RP4.3
Q2_A12: IC43.R3(A12) RP2.2
Q2_A13: IC43.R4(A13) RP2.4
Q2_A14: IC43.R5(A14) RP2.7
Q2_A15: IC43.R7(A15) RP2.9
Q2_A16: IC43.R8(A16) RP2.10
Q2_A17: IC43.R9(A17) RP4.4
Q2_A18: IC43.A9(A18(N.C.)) RP6.3
Q2_BWS0: IC43.B7(~{BWS}0)
Q2_BWS1: IC43.A7(~{BWS}1)
Q2_BWS2: IC43.A5(~{BWS}2)
Q2_BWS3: IC43.B5(~{BWS}3)
Q2_CQ_N: IC43.A1(~{CQ}) ; port QDR2_2.~{CQ}
Q2_CQ_P: IC43.A11(CQ) ; port QDR2_2.CQ
Q2_D0: IC43.P10(D0) RP4.5
Q2_D1: IC43.N11(D1) RP14.3
Q2_D2: IC43.M11(D2) RP14.5
Q2_D3: IC43.K10(D3) RP14.9
Q2_D4: IC43.J11(D4) RP14.10
Q2_D5: IC43.G11(D5) RP12.2
Q2_D6: IC43.E10(D6) RP12.5
Q2_D7: IC43.D11(D7) RP12.8
Q2_D8: IC43.C11(D8) RP6.5
Q2_D9: IC43.N10(D9) RP14.2
Q2_D10: IC43.M9(D10) RP14.4
Q2_D11: IC43.L9(D11) RP14.7
Q2_D12: IC43.J9(D12) RP14.8
Q2_D13: IC43.G10(D13) RP12.3
Q2_D14: IC43.F9(D14) RP12.4
Q2_D15: IC43.D10(D15) RP6.4
Q2_D16: IC43.C9(D16) RP12.10
Q2_D17: IC43.B9(D17) RP6.2
Q2_D18: IC43.B3(D18) RP6.7
Q2_D19: IC43.C3(D19) RP10.7
Q2_D20: IC43.D2(D20) RP10.9
Q2_D21: IC43.F3(D21) RP10.3
Q2_D22: IC43.G2(D22) RP10.5
Q2_D23: IC43.J3(D23) RP7.7
Q2_D24: IC43.L3(D24) RP7.10
Q2_D25: IC43.M3(D25) RP7.2
Q2_D26: IC43.N2(D26) RP7.4
Q2_D27: IC43.C1(D27) RP10.8
Q2_D28: IC43.D1(D28) RP10.10
Q2_D29: IC43.E2(D29) RP10.2
Q2_D30: IC43.G1(D30) RP10.4
Q2_D31: IC43.J1(D31) RP7.8
Q2_D32: IC43.K2(D32) RP7.9
Q2_D33: IC43.M1(D33) RP7.3
Q2_D34: IC43.N1(D34) RP7.5
Q2_D35: IC43.P2(D35) RP2.3
Q2_DOFF: IC43.H1(~{DOFF}) ; port QDR2_2.~{DOFF}
Q2_K_N: IC43.A6(~{K}) ; port QDR2_2.~{K}
Q2_K_P: IC43.B6(K) ; port QDR2_2.K
Q2_Q0: IC43.P11(Q0)
Q2_Q1: IC43.M10(Q1)
Q2_Q2: IC43.L11(Q2)
Q2_Q3: IC43.K11(Q3)
Q2_Q4: IC43.J10(Q4)
Q2_Q5: IC43.F11(Q5)
Q2_Q6: IC43.E11(Q6)
Q2_Q7: IC43.C10(Q7)
Q2_Q8: IC43.B11(Q8)
Q2_Q9: IC43.P9(Q9)
Q2_Q10: IC43.N9(Q10)
Q2_Q11: IC43.L10(Q11)
Q2_Q12: IC43.K9(Q12)
Q2_Q13: IC43.G9(Q13)
Q2_Q14: IC43.F10(Q14)
Q2_Q15: IC43.E9(Q15)
Q2_Q16: IC43.D9(Q16)
Q2_Q17: IC43.B10(Q17)
Q2_Q18: IC43.B2(Q18)
Q2_Q19: IC43.D3(Q19)
Q2_Q20: IC43.E3(Q20)
Q2_Q21: IC43.F2(Q21)
Q2_Q22: IC43.G3(Q22)
Q2_Q23: IC43.K3(Q23)
Q2_Q24: IC43.L2(Q24)
Q2_Q25: IC43.N3(Q25)
Q2_Q26: IC43.P3(Q26)
Q2_Q27: IC43.B1(Q27)
Q2_Q28: IC43.C2(Q28)
Q2_Q29: IC43.E1(Q29)
Q2_Q30: IC43.F1(Q30)
Q2_Q31: IC43.J2(Q31)
Q2_Q32: IC43.K1(Q32)
Q2_Q33: IC43.L1(Q33)
Q2_Q34: IC43.M2(Q34)
Q2_Q35: IC43.P1(Q35)
Q2_RPS: IC43.A8(~{RPS}) ; port QDR2_2.~{RPS}
Q2_WPS: IC43.A4(~{WPS}) ; port QDR2_2.~{WPS}
NetIC45_9: port QDR2_VTT_GOOD, sheet U_QDRII_power/QDR2_VTT_GOOD

Not connected (* = marked no-connect by the designer): IC43 R1(TDO) R10(TMS)* R11(TDI)*; RP4 7*

### Buses and harness runs
bus Q2_A[18..0]
bus Q2_BWS[3..0]
bus Q2_D[35..0]
bus Q2_Q[35..0]

### Layout directives
differential pair: Q2_CQ_N, Q2_CQ_P, Q2_K_N, Q2_K_P

### Notes on the sheet
- QDRII Memories finally will be not mounted in this White Rabbit Switch V3.4 version.
- Termination resistors must be placed close to CY7C1314CV18-250BZC.
- Title:
- Size:
- Revision:
- A4
- Drawn by:
- Date:
- Sheet
- of
- C/Baza, Parcela 19, Nave 3
- Polнgono Industrial Juncaril
- 18210-Peligros-Granada
- Espaсa
- Project:
- www.sevensols.com

### Library data of the parts
IC43 = CY7C1314CV18: 18-Mbit (512Kx36) QDRII SRAM 2-Word Burst Architecture; Value: CY7C1314KV18-250BZC; Distributor1 PN: CY7C1314KV18-250BZC-ND; Distributor1: Digikey
RP2 RP4 RP6 RP7 RP10 RP12 RP14 = EXB-E10C470J: 47R, 62.5mW Chip Resistor Bussed Network; Manufacturer1: Panasonic; Tolerance: ±5%; TCR: 200ppm; Case: EXBE; Manufacturer1 PN: EXB-E10C470J; Distributor1: DigiKey; Distributor1 PN: U8470CT-ND; Power Rating: 62.5mW

## Sheet QDRII_power.SchDoc: QDRII_power
size A4; Date: 18/06/2014; DrawnBy: J. Gabriel R.E.; Organization: Seven Solutions S.L.; Address1: C/Baza, Parcela 19, Nave 3; Address2: Polнgono Ind. Juncaril; Address3: 18210-Peligros-Granada; Address4: Spain; Revision: 3.4; SheetNumber: 21; SheetTotal: 23; WebAddress: www.sevensols.com; Project: White Rabbit; ProjectName: White Rabbit
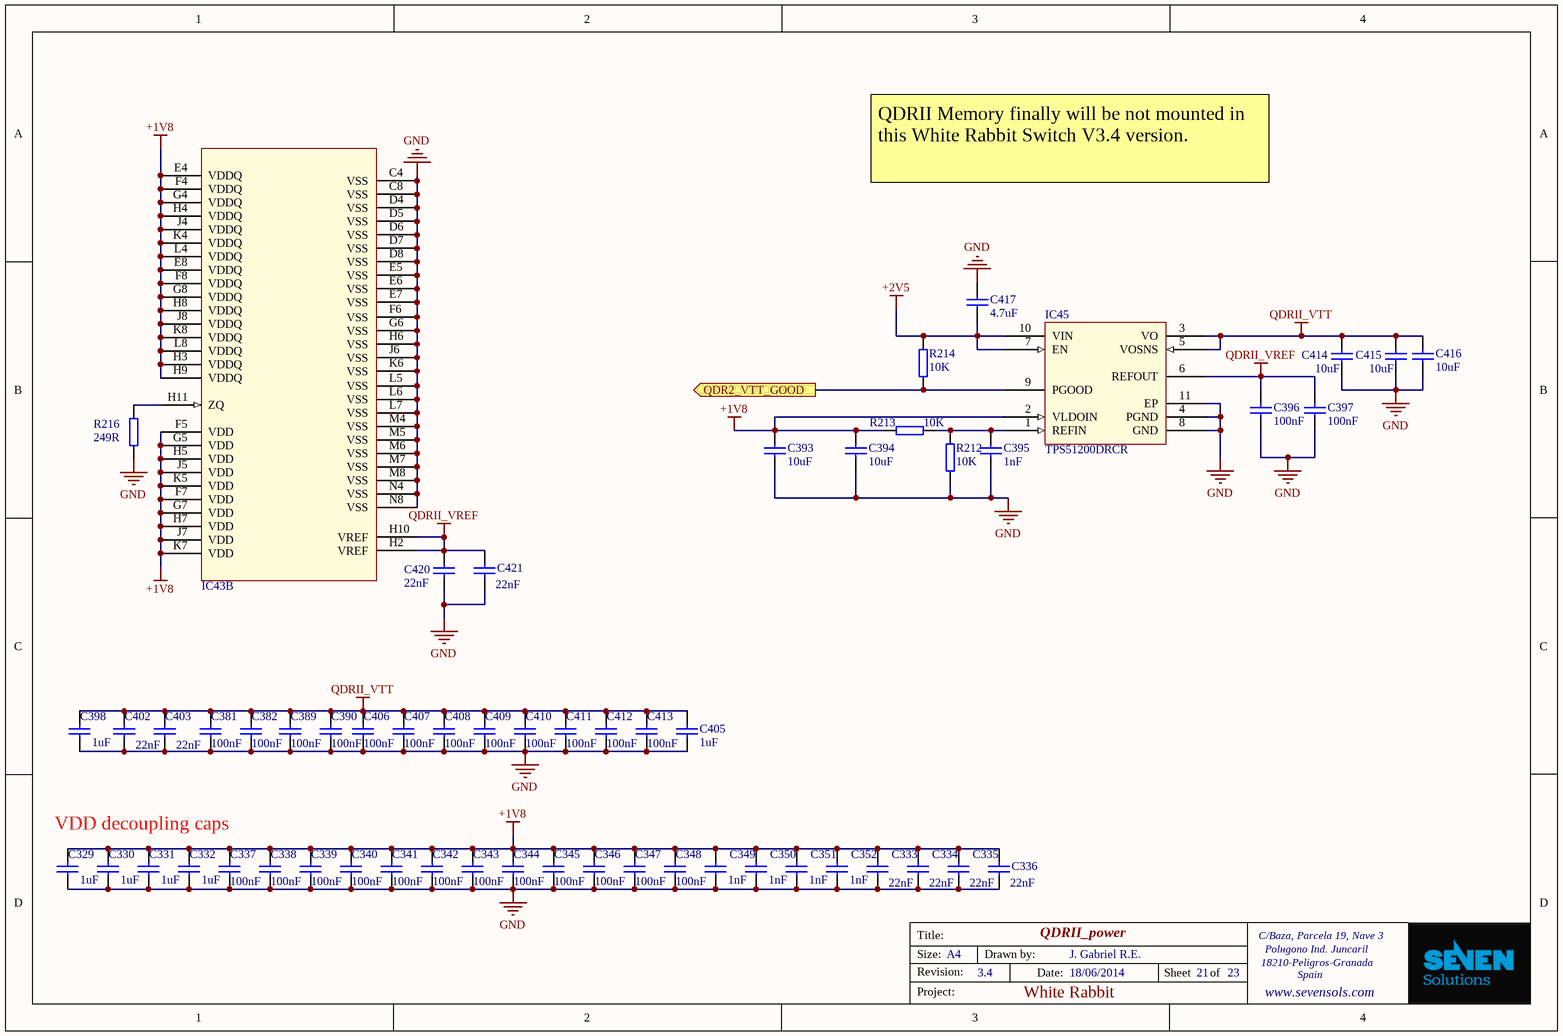
[diagram p8: QDRII_power.SchDoc]

### Parts
C329  1uF  [CC1005-0402]
C330  1uF  [CC1005-0402]
C331  1uF  [CC1005-0402]
C332  1uF  [CC1005-0402]
C333  22nF  [CC1005-0402]
C334  22nF  [CC1005-0402]
C335  22nF  [CC1005-0402]
C336  22nF  [CC1005-0402]
C337  100nF  [CC1005-0402]
C338  100nF  [CC1005-0402]
C339  100nF  [CC1005-0402]
C340  100nF  [CC1005-0402]
C341  100nF  [CC1005-0402]
C342  100nF  [CC1005-0402]
C343  100nF  [CC1005-0402]
C344  100nF  [CC1005-0402]
C345  100nF  [CC1005-0402]
C346  100nF  [CC1005-0402]
C347  100nF  [CC1005-0402]
C348  100nF  [CC1005-0402]
C349  1nF  [CC1005-0402]
C350  1nF  [CC1005-0402]
C351  1nF  [CC1005-0402]
C352  1nF  [CC1005-0402]
C381  100nF  [CC1005-0402]
C382  100nF  [CC1005-0402]
C389  100nF  [CC1005-0402]
C390  100nF  [CC1005-0402]
C393  10uF  [CC1608-0603]
C394  10uF  [CC1608-0603]
C395  1nF  [CC1005-0402]
C396  100nF  [CC1005-0402]
C397  100nF  [CC1005-0402]
C398  1uF  [CC1005-0402]
C402  22nF  [CC1005-0402]
C403  22nF  [CC1005-0402]
C405  1uF  [CC1005-0402]
C406  100nF  [CC1005-0402]
C407  100nF  [CC1005-0402]
C408  100nF  [CC1005-0402]
C409  100nF  [CC1005-0402]
C410  100nF  [CC1005-0402]
C411  100nF  [CC1005-0402]
C412  100nF  [CC1005-0402]
C413  100nF  [CC1005-0402]
C414  10uF  [CC1608-0603]
C415  10uF  [CC1608-0603]
C416  10uF  [CC1608-0603]
C417  4.7uF  [CC1608-0603]
C420  22nF  [CC1005-0402]
C421  22nF  [CC1005-0402]
IC43  CY7C1314KV18-250BZC  [BGA165C100P11X15_1300X1500X140]  (value not drawn)  (part B of 2)
IC45  TPS51200DRCR  [SON50P300X300X100-11N-R175X250]
R212  10k  [0402]
R213  10k  [0402]
R214  10k  [0402]
R216  249R  [0402]

### Ports
QDR2_VTT_GOOD (out)

### Nets
+1V8: C329.2 C330.2 C331.2 C332.2 C333.2 C334.2 C335.2 C336.2 C337.1 C338.1 C339.1 C340.1 C341.1 C342.1 C343.1 C344.1 C345.1 C346.1 C347.1 C348.1 C349.2 C350.2 C351.2 C352.2 C393.2 C394.2 IC43.E4(VDDQ) IC43.E8(VDDQ) IC43.F4(VDDQ) IC43.F5(VDD) IC43.F7(VDD) IC43.F8(VDDQ) IC43.G4(VDDQ) IC43.G5(VDD) IC43.G7(VDD) IC43.G8(VDDQ) IC43.H3(VDDQ) IC43.H4(VDDQ) IC43.H5(VDD) IC43.H7(VDD) IC43.H8(VDDQ) IC43.H9(VDDQ) IC43.J4(VDDQ) IC43.J5(VDD) IC43.J7(VDD) IC43.J8(VDDQ) IC43.K4(VDDQ) IC43.K5(VDD) IC43.K7(VDD) IC43.K8(VDDQ) IC43.L4(VDDQ) IC43.L8(VDDQ) IC45.2(VLDOIN) R213.2
+2V5: C417.1 IC45.7(EN) IC45.10(VIN) R214.2
GND: C329.1 C330.1 C331.1 C332.1 C333.1 C334.1 C335.1 C336.1 C337.2 C338.2 C339.2 C340.2 C341.2 C342.2 C343.2 C344.2 C345.2 C346.2 C347.2 C348.2 C349.1 C350.1 C351.1 C352.1 C381.2 C382.2 C389.2 C390.2 C393.1 C394.1 C395.1 C396.2 C397.2 C398.1 C402.1 C403.1 C405.1 C406.2 C407.2 C408.2 C409.2 C410.2 C411.2 C412.2 C413.2 C414.1 C415.1 C416.1 C417.2 C420.1 C421.1 IC43.C4(VSS) IC43.C8(VSS) IC43.D4(VSS) IC43.D5(VSS) IC43.D6(VSS) IC43.D7(VSS) IC43.D8(VSS) IC43.E5(VSS) IC43.E6(VSS) IC43.E7(VSS) IC43.F6(VSS) IC43.G6(VSS) IC43.H6(VSS) IC43.J6(VSS) IC43.K6(VSS) IC43.L5(VSS) IC43.L6(VSS) IC43.L7(VSS) IC43.M4(VSS) IC43.M5(VSS) IC43.M6(VSS) IC43.M7(VSS) IC43.M8(VSS) IC43.N4(VSS) IC43.N8(VSS) IC45.4(PGND) IC45.8(GND) IC45.11(EP) R212.1 R216.1
QDRII_VREF: C396.1 C397.1 C420.2 C421.2 IC43.H2(VREF) IC43.H10(VREF) IC45.6(REFOUT)
QDRII_VTT: C381.1 C382.1 C389.1 C390.1 C398.2 C402.2 C403.2 C405.2 C406.1 C407.1 C408.1 C409.1 C410.1 C411.1 C412.1 C413.1 C414.2 C415.2 C416.2 IC45.3(VO) IC45.5(VOSNS)
NetC395_2: C395.2 IC45.1(REFIN) R212.2 R213.1
NetIC43_H11: IC43.H11(ZQ) R216.2
NetIC45_9: IC45.9(PGOOD) R214.1 ; port QDR2_VTT_GOOD

### Notes on the sheet
- QDRII Memory finally will be not mounted in this White Rabbit Switch V3.4 version.
- VDD decoupling caps
- Title:
- Size:
- Revision:
- A4
- Drawn by:
- Date:
- Sheet
- of
- Project:

### Library data of the parts
C329-C332 C398 C405 = CC0402_1UF_16V_10%_X5R: Capacitor; Manufacturer1: TDK; Manufacturer1 PN: C1005X5R1C105K; TC: X5R; Tolerance: ±10%; Voltage: 16V; Published: 8-Jun-2000; LatestRevisionDate: 17-Jul-2002; LatestRevisionNote: Re-released for DXP Platform.; PackageReference: RAD-0.3; Publisher: Altium Limited; Distributor1: Digikey; Distributor1 PN: 445-4978-1-ND; Case: 0402; Value: 1uF
C333-C336 C402 C403 C420 C421 = CC0402_22NF_25V_10%_X7R: Capacitor; Manufacturer1: TDK; Manufacturer1 PN: C1005X7R1E223K; TC: X7R; Tolerance: ±10%; Voltage: 25V; Published: 8-Jun-2000; LatestRevisionDate: 17-Jul-2002; LatestRevisionNote: Re-released for DXP Platform.; PackageReference: RAD-0.3; Publisher: Altium Limited; Distributor1: Digikey; Distributor1 PN: 445-1261-1-ND; Case: 0402; Value: 22nF
C337-C348 C381 C382 C389 C390 C396 C397 C406-C413 = CC0402_100NF_16V_10%_X7R: Capacitor; Manufacturer1: TDK; Manufacturer1 PN: C1005X7R1C104K; TC: X7R; Tolerance: ±10%; Voltage: 16V; Published: 8-Jun-2000; LatestRevisionDate: 17-Jul-2002; LatestRevisionNote: Re-released for DXP Platform.; PackageReference: RAD-0.3; Publisher: Altium Limited; Distributor1: Digikey; Distributor1 PN: 445-4952-1-ND; Case: 0402; Value: 100nF
C349-C352 C395 = CC0402_1NF_25V_10%_X7R: Capacitor; Manufacturer1: TDK; Manufacturer1 PN: C1005X7R1E102K; TC: X7R; Tolerance: ±10%; Voltage: 25V; Published: 8-Jun-2000; LatestRevisionDate: 17-Jul-2002; LatestRevisionNote: Re-released for DXP Platform.; PackageReference: RAD-0.3; Publisher: Altium Limited; Distributor1: Digikey; Distributor1 PN: 445-4924-1-ND; Case: 0402; Value: 1nF
C393 C394 C414-C416 = CC0603_10UF_6.3V_20%_X5R: Capacitor; Manufacturer1: TDK; Manufacturer1 PN: C1608X5R0J106M; TC: X5R; Tolerance: ±20%; Voltage: 6.3V; Published: 8-Jun-2000; LatestRevisionDate: 17-Jul-2002; LatestRevisionNote: Re-released for DXP Platform.; PackageReference: RAD-0.3; Publisher: Altium Limited; Distributor1: Digikey; Distributor1 PN: 445-4112-1-ND; Case: 0603; Value: 10uF
C417 = CC0603_4.7UF_10V_10%_X5R: Capacitor; Manufacturer1: TDK; Manufacturer1 PN: C1608X5R1A475K; TC: X5R; Tolerance: ±10%; Voltage: 10V; Published: 8-Jun-2000; LatestRevisionDate: 17-Jul-2002; LatestRevisionNote: Re-released for DXP Platform.; PackageReference: RAD-0.3; Publisher: Altium Limited; Distributor1: Digikey; Distributor1 PN: 445-5170-1-ND; Case: 0603; Value: 4.7uF
IC43 = CY7C1314CV18: as IC43 on sheet QDRII_mem; Value: CY7C1314KV18-250BZC; Distributor1 PN: CY7C1314KV18-250BZC -ND; Distributor1: Digikey
IC45 = TPS51200: Sink/Source DDR Termination Regulator; Value: TPS51200DRCR; Distributor1 PN: 296-26978-1-ND; Distributor1: Digikey
R212-R214 = R0402_10K_±1%_0.1W_100PPM: SMD Resistor; Manufacturer1: Panasonic; Manufacturer1 PN: ERJ-2RKF1002X; TCR: 100ppm; Power Rating: 0.1W; Tolerance: ±1%; Case: 0402; Distributor1: DigiKey; Distributor1 PN: P10.0KLCT-ND; Value: 10K
R216 = R0402_249R_±1%_0.1W_100PPM: SMD Resistor; Manufacturer1: Panasonic; Manufacturer1 PN: ERJ-2RKF2490X; TCR: 100ppm; Power Rating: 0.1W; Tolerance: ±1%; Case: 0402; Distributor1: DigiKey; Distributor1 PN: P249LCT-ND; Value: 249R

## Nets that join several sheets
+1V8: CPU_EBI1_FPGA_Memory (16 pins), FPGA_Configuration (C62.2 C63.2 IC36.A6 IC36.H3), QDRII_mem (IC43.P6 IC43.R6), QDRII_power (54 pins)
+2V5: CPU_EBI1_FPGA_Memory (R166.2), CPU_100M_Ethernet (7 pins), FPGA_Configuration (22 pins), SMI_Link_7-12 (J3.29 J3.31), QDRII_power (C417.1 IC45.7 IC45.10 R214.2)
+3V3: RS232_and_USB_ports (C242.1 C244.1 IC31.16), CPU_EBI1_FPGA_Memory (C219.1 IC25.3 IC25.6 R165.2), CPU_100M_Ethernet (L12.2)
GND: RS232_and_USB_ports (8 pins), CPU_EBI1_FPGA_Memory (18 pins), CPU_100M_Ethernet (R187.2 R192.2), FPGA_GTX (41 pins), FPGA_Configuration (17 pins), uTCA_Tongue3 (58 pins), SMI_Link_7-12 (J3.33 J3.34 J3.35 J3.36), QDRII_mem (IC43.R2), QDRII_power (81 pins)
QDRII_VTT: QDRII_mem (14 pins), QDRII_power (21 pins)